# EAGLE design Adafruit EZ-SFX with Amp (EAGLE 6.6.0)
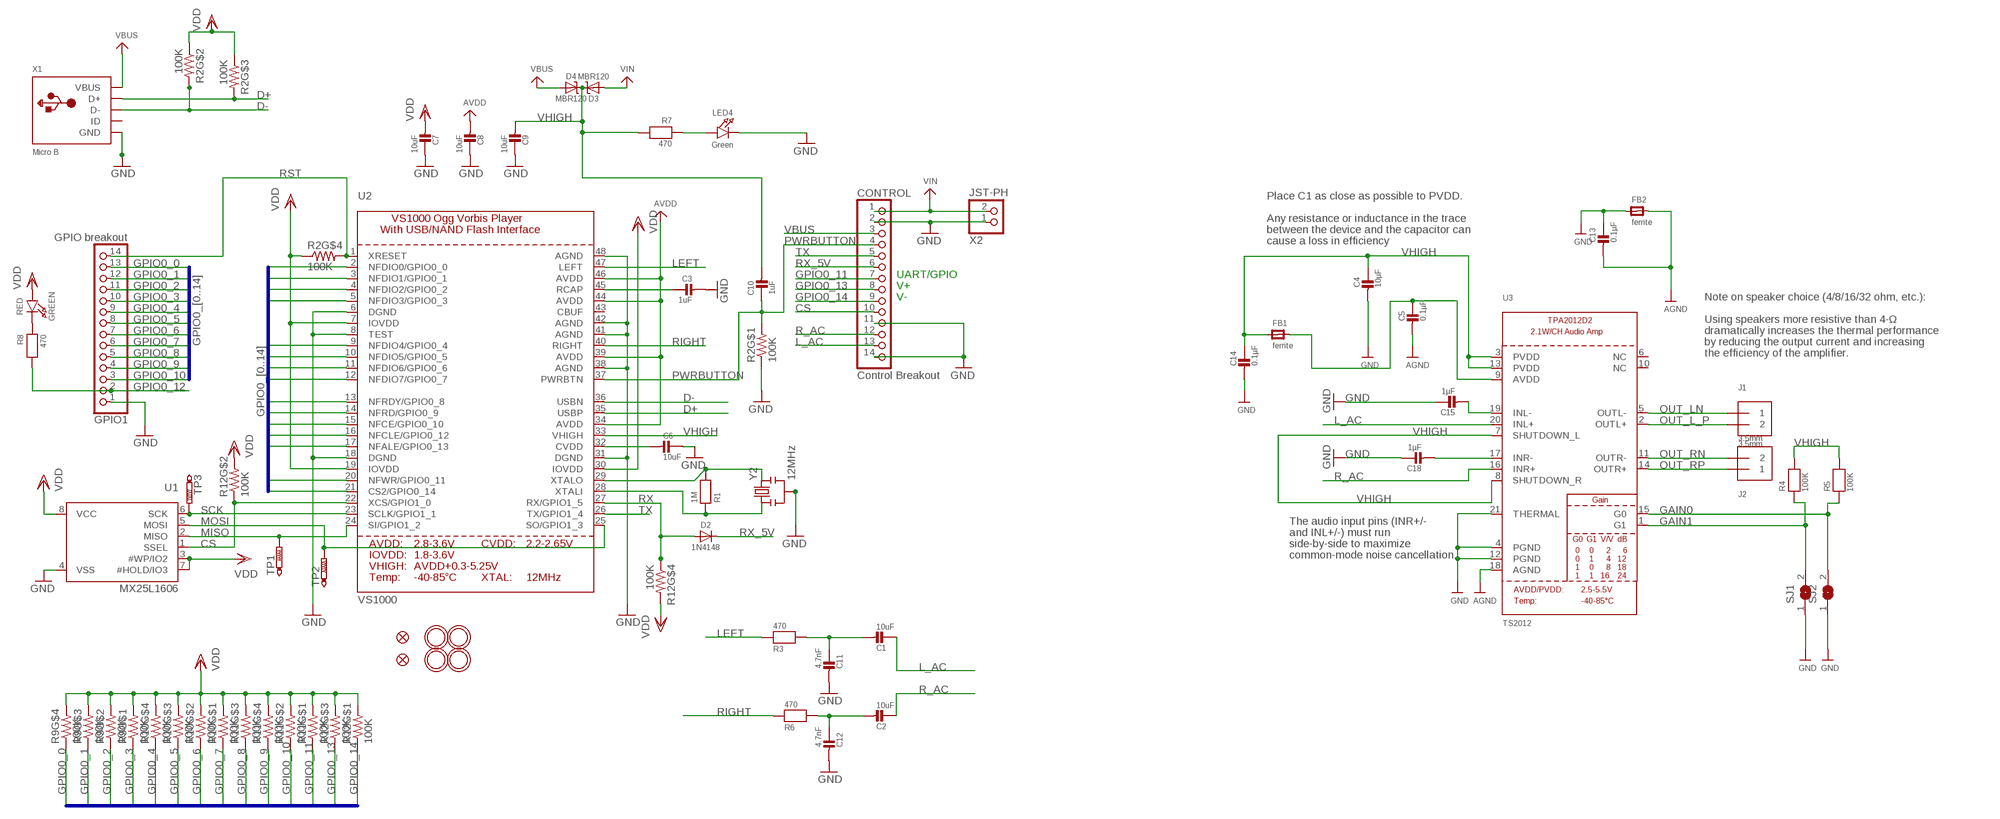
[diagram p0: schematic, sheet 1]

## Parts
C1  10uF  CAP_CERAMIC0805-NOOUTLINE  [0805-NO]
C2  10uF  CAP_CERAMIC0805_10MGAP  [0805_10MGAP]
C3  1uF  CAP_CERAMIC0805-NOOUTLINE  [0805-NO]
C4  10µF  CAP_CERAMIC0805-NOOUTLINE  [0805-NO]
C5  0.1µF  CAP_CERAMIC0805-NOOUTLINE  [0805-NO]
C6  10uF  CAP_CERAMIC0805_10MGAP  [0805_10MGAP]
C7  10uF  CAP_CERAMIC0805_10MGAP  [0805_10MGAP]
C8  10uF  CAP_CERAMIC0805-NOOUTLINE  [0805-NO]
C9  10uF  CAP_CERAMIC0805-NOOUTLINE  [0805-NO]
C10  1uF  CAP_CERAMIC0805-NOOUTLINE  [0805-NO]
C11  4.7nF  CAP_CERAMIC0805-NOOUTLINE  [0805-NO]
C12  4.7nF  CAP_CERAMIC0805-NOOUTLINE  [0805-NO]
C13  0.1µF  CAP_CERAMIC0805-NOOUTLINE  [0805-NO]
C14  0.1µF  CAP_CERAMIC0805-NOOUTLINE  [0805-NO]
C15  1µF  CAP_CERAMIC0805-NOOUTLINE  [0805-NO]
C18  1µF  CAP_CERAMIC0805-NOOUTLINE  [0805-NO]
CONTROL  Control Breakout  PINHD-1X14-CB  [1X14-CB]
D2  1N4148  DIODESOD-323  [SOD-323]
D3  MBR120  DIODE-SCHOTTKYSOD-123  [SOD-123]
D4  MBR120  DIODE-SCHOTTKYSOD-123  [SOD-123]
FB1  ferrite  FERRITE_0805MP  [_0805MP]
FB2  ferrite  FERRITE_0805MP  [_0805MP]
FID1  FIDUCIAL""  [FIDUCIAL_1MM]
FID2  FIDUCIAL""  [FIDUCIAL_1MM]
GPIO1  GPIO breakout  PINHD-1X14-CB  [1X14-CB]
GREEN  RED  LED0805_NOOUTLINE  [CHIPLED_0805_NOOUTLINE]
J1  3.5mm  TERMBLOCK_1X2  [TERMBLOCK_1X2-3.5MM]
J2  3.5mm  TERMBLOCK_1X2  [TERMBLOCK_1X2-3.5MM]
LED4  Green  LED0805_NOOUTLINE  [CHIPLED_0805_NOOUTLINE]
R1  1M  RESISTOR0805_NOOUTLINE  [0805-NO]
R2  100K  RESISTOR_4PACK_US  [RESPACK_4X0603]
R3  470  RESISTOR0805_NOOUTLINE  [0805-NO]
R4  100K  RESISTOR0805_NOOUTLINE  [0805-NO]
R5  100K  RESISTOR0805_NOOUTLINE  [0805-NO]
R6  470  RESISTOR0805_NOOUTLINE  [0805-NO]
R7  470  RESISTOR0805_NOOUTLINE  [0805-NO]
R8  470  RESISTOR0805_NOOUTLINE  [0805-NO]
R9  100K  RESISTOR_4PACK_US  [RESPACK_4X0603]
R10  100K  RESISTOR_4PACK_US  [RESPACK_4X0603]
R11  100K  RESISTOR_4PACK_US  [RESPACK_4X0603]
R12  100K  RESISTOR_4PACK_US  [RESPACK_4X0603]
SJ1  SOLDERJUMPER  [SOLDERJUMPER_ARROW_NOPASTE]
SJ2  SOLDERJUMPERCLOSED  [SOLDERJUMPER_CLOSEDWIRE]
TP1  PTR1B1,27  [B1,27]
TP2  PTR1B1,27  [B1,27]
TP3  PTR1B1,27  [B1,27]
U1  MX25L1606  SPIFLASH_SOIC8208MIL  [SOIC8_208MIL]
U2  VS1000  [LQFP48]
U3  TS2012  AUDIOAMP_TPA2012D2  [WQFN20]
U$5  MOUNTINGHOLE2.5  [MOUNTINGHOLE_2.5_PLATED]
U$6  MOUNTINGHOLE2.5  [MOUNTINGHOLE_2.5_PLATED]
U$7  MOUNTINGHOLE2.5  [MOUNTINGHOLE_2.5_PLATED]
U$8  MOUNTINGHOLE2.5  [MOUNTINGHOLE_2.5_PLATED]
X1  Micro B  USBMICRO_20329  [4UCONN_20329]
X2  JST-PH  CON_JST_PH_2PIN  [JSTPH2]
Y2  12MHz  RESONATORSMD  [RESONATOR-SMD]

## Nets
AGND: C5.2 C13.2 FB2.2 U3.18(AGND)
AVDD: C8.2 U2.34(AVDD) U2.39(AVDD) U2.44(AVDD) U2.46(AVDD)
CS: CONTROL.10 R12.2 U1.1(SSEL) U2.22(XCS/GPIO1_0)
D+: R2.6 U2.35(USBP) X1.D+
D-: R2.7 U2.36(USBN) X1.D-
GAIN0: R5.1 SJ2.2 U3.15(G0)
GAIN1: R4.1 SJ1.2 U3.1(G1)
GND: C3.2 C4.2 C6.1 C7.1 C8.1 C9.1 C11.2 C12.2 C13.1 C14.2 C15.1 C18.1 CONTROL.2 CONTROL.11 CONTROL.14 FB2.1 GPIO1.1 LED4.C R2.1 SJ1.1 SJ2.1 U1.4(VSS) U2.6(DGND) U2.8(TEST) U2.18(DGND) U2.31(DGND) U2.38(AGND) U2.41(AGND) U2.42(AGND) U2.48(AGND) U3.4(PGND) U3.12(PGND) U3.21(THERMAL) X1.BASE@1(GND) X1.BASE@2(GND) X1.GND X1.SPRT@1(GND) X1.SPRT@2(GND) X1.SPRT@3(GND) X1.SPRT@4(GND) X2.1 Y2.2
GPIO0_0: GPIO1.13 R9.4 U2.2(NFDIO0/GPIO0_0)
GPIO0_1: GPIO1.12 R9.3 U2.3(NFDIO1/GPIO0_1)
GPIO0_2: GPIO1.11 R9.2 U2.4(NFDIO2/GPIO0_2)
GPIO0_3: GPIO1.10 R9.1 U2.5(NFDIO3/GPIO0_3)
GPIO0_4: GPIO1.9 R10.4 U2.9(NFDIO4/GPIO0_4)
GPIO0_5: GPIO1.8 R10.3 U2.10(NFDIO5/GPIO0_5)
GPIO0_6: GPIO1.7 R10.2 U2.11(NFDIO6/GPIO0_6)
GPIO0_7: GPIO1.6 R10.1 U2.12(NFDIO7/GPIO0_7)
GPIO0_8: GPIO1.5 R11.3 U2.13(NFRDY/GPIO0_8)
GPIO0_9: GPIO1.4 R11.4 U2.14(NFRD/GPIO0_9)
GPIO0_10: GPIO1.3 R11.2 U2.15(NFCE/GPIO0_10)
GPIO0_11: CONTROL.7 R11.1 U2.20(NFWR/GPIO0_11)
GPIO0_12: GPIO1.2 R8.2 U2.16(NFCLE/GPIO0_12)
GPIO0_13: CONTROL.8 R12.3 U2.17(NFALE/GPIO0_13)
GPIO0_14: CONTROL.9 R12.1 U2.21(CS2/GPIO0_14)
L_AC: C1.1 CONTROL.13 U3.20(INL+)
LEFT: R3.1 U2.47(LEFT)
MISO: TP1.TP U1.2(MISO) U2.24(SI/GPIO1_2)
MOSI: TP2.TP U1.5(MOSI) U2.25(SO/GPIO1_3)
N$1: LED4.A R7.1
N$2: C2.2 C12.1 R6.2
N$3: C3.1 U2.45(RCAP)
N$4: R1.2 U2.29(XTALO) Y2.3
N$5: C6.2 U2.32(CVDD)
N$6: C1.2 C11.1 R3.2
N$7: C5.1 FB1.2 U3.9(AVDD)
N$8: GREEN.C R8.1
N$9: C15.2 U3.19(INL-)
N$10: C18.2 U3.17(INR-)
N$12: R1.1 U2.28(XTALI) Y2.1
OUT_L_P: J1.2 U3.2(OUTL+)
OUT_LN: J1.1 U3.5(OUTL-)
OUT_RN: J2.2 U3.11(OUTR-)
OUT_RP: J2.1 U3.14(OUTR+)
PWRBUTTON: C10.1 CONTROL.4 R2.8 U2.37(PWRBTN)
R_AC: C2.1 CONTROL.12 U3.16(INR+)
RIGHT: R6.1 U2.40(RIGHT)
RST: GPIO1.14 R2.5 U2.1(XRESET)
RX: D2.A R12.4 U2.27(RX/GPIO1_5)
RX_5V: CONTROL.6 D2.C
SCK: TP3.TP U1.6(SCK) U2.23(SCLK/GPIO1_1)
TX: CONTROL.5 U2.26(TX/GPIO1_4)
VBUS: CONTROL.3 D4.A X1.VBUS
VDD: C7.2 GREEN.A R2.2 R2.3 R2.4 R9.5 R9.6 R9.7 R9.8 R10.5 R10.6 R10.7 R10.8 R11.5 R11.6 R11.7 R11.8 R12.5 R12.6 R12.7 R12.8 U1.3(#WP/IO2) U1.7(#HOLD/IO3) U1.8(VCC) U2.7(IOVDD) U2.19(IOVDD) U2.30(IOVDD)
VHIGH: C4.1 C9.2 C10.2 C14.1 D3.C D4.C FB1.1 R4.2 R5.2 R7.2 U2.33(VHIGH) U3.3(PVDD) U3.7(SHUTDOWN_L) U3.8(SHUTDOWN_R) U3.13(PVDD)
VIN: CONTROL.1 D3.A X2.2
Unconnected: U2.43(CBUF) U3.6(NC) U3.10(NC) X1.ID

## Buses
GPIO0_[0..14]

## Notes on the sheet
- Place C1 as close as possible to PVDD.
- Any resistance or inductance in the trace
- between the device and the capacitor can
- cause a loss in efficiency
- UART/GPIO
- V+
- V- | Note on speaker choice (4/8/16/32 ohm, etc.):
- Using speakers more resistive than 4-Ω
- dramatically increases the thermal performance
- by reducing the output current and increasing
- the efficiency of the amplifier.
- The audio input pins (INR+/-
- and INL+/-) must run
- side-by-side to maximize
- common-mode noise cancellation.

## Library data of the parts
C1-C15 C18 = microbuilder:CAP_CERAMIC: Ceramic Capacitors For new designs, use the packages preceded by an '_' character since they are more reliable: The following footprints should be used on most boards: _0402 - Standard footprint for regular board layouts _0603 - Standard footprint for regular board layouts _0805 - Standard footprint for regular board layouts For extremely tight-pitch boards where space is at a premium, the following 'micro-pitch' footprints can be used (smaller pads, no silkscreen outline, etc.): _0402MP - Micro-pitch footprint for very dense/compact boards _0603MP - Micro-pitch footprint for very dense/compact boards _0805MP - Micro-pitch footprint for very dense/compact boards Commonly Stocked Parts 0402 - 0402 Surface Mount Capacitors 16pF 50V 5% [Digikey: 445-4899-2-ND] 18pF 50V 5% [Digikey: 490-1281-2-ND] 22pF 50V 5% [Digikey: 490-1283-2-ND] 68pF 50V 5% [Digikey: 490-1289-2-ND] 0.1uF 10V 10% [Digikey: 490-1318-2-ND] 1.0uF 6.3V 10% [Digikey: 490-1320-2-ND] 0603 - 0603 Surface Mount Capacitors 16 pF 50V 5% [Digikey: 445-5051-2-ND] 22 pF 50V [Digikey: PCC220ACVTR-ND] 33 pF 50V 5% [Digikey: 490-1415-1-ND] 56pF 50V 5% [Digikey: 490-1421-1-ND] 220pF 50V 5% [Digikey: 445-1285-1-ND] 680 pF 50V 2200 pF 50V 5% C0G [Digikey: 445-1297-1-ND] 5600 pF 100V 5% X7R [Digikey: 478-3711-1-ND] 0.1 µF 25V 10% [Digikey: PCC2277TR-ND] 0.22 µF 16V 10% X7R [Digikey: 445-1318-1-ND] 1.0 µF 25V 10% [Digikey: 445-5146-2-ND] 0603 - RF Specific 3pF 250V +/-0.1pF RF [Digikey: 712-1347-1-ND] 18 pF 250V 5% [Digikey: 478-3505-1-ND or 712-1322-1-ND] 56 pF 250V 5% C0G RF [Digikey: 490-4867-1-ND] 68 pF 250V RF [Digikey: 490-4868-1-ND] 0805 - 0805 Surface Mount Capacitors 220 pF 250V 2% RF Ceramic Capacitor [Digikey: 712-1398-1-ND] 1000 pF 50V 2% NP0 Ceramic Capacitor [Digikey: 478-3760-1-ND] 0.1 µF 25V 10% Ceramic Capacitor [Digikey: PCC1828TR-ND] 1.0 µF 16V 10% Ceramic Capacitor[Digikey: 490-1691-2-ND] 10.0 µF 10V 10% Ceramic Capacitor[Digikey: 709-1228-1-ND] 10.0 uF 16V 10% Ceramic Capacitor [Digikey: 478-5165-2-ND] 47 uF 6.3V 20% Ceramic Capacitor [Digikey: 587-1779-1-ND or 399-5506-1-ND] 1206 - 1206 Surface Mount Capacitors 47uF 10V 20% Ceramic Capacitor [Digikey: 490-5528-1-ND or 399-5508-1-ND or 445-6010-1-ND] 100uF 6.3V -20%, +80% Y5V Ceramic Capacitor (Digikey: 490-4512-1-ND, Mouser: 81-GRM31CF50J107ZE1L)
CONTROL GPIO1 = adafruit:PINHD-1X14: PIN HEADER
D2 = microbuilder:DIODE: Diode SMA Model Volts Amps Type Vf Ir Digikey # Notes SSA34-E3 40V 3A Schottky 480mV @ 3A 200uA @ 40V SSA34-E3/61TGITR-ND CDBA120-G 20V 1A Schottky 500mV @ 1A 500uA @ 20V 641-1014-6-ND REEL MBRA210 10V 2A Schottky 350mV @ 2A 700uA @ 10V MBRA210LT3 SOD-123 Model Volts Amps Type Vf Ir Order # Notes BAT54T1G 30V 200mA Schottky 800mV @ 200mA 2uA @ 25V BAT54T1GOSTR-ND B0530W 30V 500mA Schottky 430mV @ 500mA 130uA @ 30V B0530W-FDICT-ND REEL MBR120 20V 1A Schottky 340mV @ 1A MBR120VLSFT1GOSCT-ND SOD-323 Model Volts Amps Type Vf Ir Order # Notes PMEG2005EJ 20V 500mA Schottky 355mV @ 500mA 568-4110-1-ND ZLLS410 10V 570mA Schottky 380mV @ 570mA ZLLS410CT-ND 1N4148WS 75V 150mA Silicon/Simple 1V 1N4148WSFSCT-ND REEL SOD-523 Model Volts Amps Type Vf Ir Order # Notes BAT54XV2 30V 200mA Schottky 0.8V @ 100mA BAT54XV2CT-ND TB751S 30V 30mA Schottky RB751S-40TE61CT-ND SOT23-R/W (R = Solder Paste/Reflow Ovens, W = Hand-Soldering) Model Volts Amps Type Vf Ir Order # Notes BAT54FILM 40V 300mA Schottky 497-7162-1-ND POWERDI-5 Model Volts Amps Type Vf Ir Order # Notes PDS560 60V 5A Schottky 670mV @ 5A 150uA @ 60V PDS560DICT-ND
D3 D4 = microbuilder:DIODE-SCHOTTKY
FB1 FB2 = microbuilder:FERRITE: Ferrite Bead 0603 MMZ1608B121C - 120 Ohm @ 100MHz, 600mA, 0.15 Ohm DC Resistance - Digikey: 445-2164-1-ND BK1608HW121-T - 120 Ohm, 600mA Ferrite Chip - Digikey: 587-1876-2-ND 0805 HZ0805B272R-10 - 2.7K Ohm @ 100MHz, 200mA, 0.8 Ohm DC Resistance - Digikey: 240-2504-1-ND (see also Murata BLM21BD272SN1L) MMZ2012Y152B - 1.5K Ohm @ 100MHz, 500mA, 0.4 Ohm DC Resistance - Digikey: 445-1560-1-ND - Mainly for high frequency (80-400MHz) MMZ2012R102A - 1K Ohm @ 100MHz, 500mA, 0.3 Ohm DC Resistance - Digikey: 445-1555-2-ND - More general purpose (10-200MHz)
FID1 FID2 = microbuilder:FIDUCIAL: Fiducial Alignment Points Various fiducial points for machine vision alignment.; BOM: EXCLUDE
GREEN LED4 = microbuilder:LED: LED 0603 - 0603 Surface Mount Package 2mA: Green LED - Low Power (3.9mcd, 2ma, 1.7Vf) - Digikey: 475-2709-2-ND Orange LED - Low Power (9.8mcd, 2ma, 1.8Vf) - Digikey: 475-1194-2-ND Red LED - Low Power (5mcd, 2ma, 1.8Vf) - Digikey: 475-1195-2-ND Yellow LED - Low Power (7mcd, 2ma, 1.8Vf) - Digikey: 475-1196-2-ND 5mA: Blue LED - Low Power (17mcd, 5ma, 2.9Vf) - Digikey: LNJ937W8CRACT-ND 0805 - 0805 Surface Mount Package 2mA: Red LED (8.8mcd, 2mA, 1.8Vf, Clear) - Low Power [Digikey: 475-2510-1-ND] Green LED (5mcd, 2mA, 1.8Vf, Clear) - Low Power [Digikey: 475-2730-1-ND] Yellow LED (11.3mcd, 2mA, 1.8Vf, Clear) - Low Power [Digikey: 475-2555-1-ND] 20mA: Red LED (104mcd, 20mA, Diffused) - LS R976 [Digikey: 475-1278-6-ND] Red LED (12mcd, 20mA, 2.0Vf, Clear) - APT2012EC [Digikey: 754-1128-1-ND] Green LED (15mcd, 20mA, 2.2Vf, Clear) - APT2012GC [Digikey: 754-1131-1-ND] Orange LED (160mcd, 20mA, 2.1Vf, Clear) - APT2012SECK [Digikey: 754-1130-1-ND] 1206 - 1206 Surface Mount Package Green LED (26mcd, 20mA, Diffused) - LG N971 [Digikey: 475-1407-6-ND] Red LED (15mcd, 20mA, Diffused) - LH N974 [Digikey: 475-1416-6-ND] Cree - Cree High-Power Surface Mount LEDs XPEBWT-L1-0000-00D50 - White 111lm 350mA 2.9Vf 6200K 110° XTEAWT-00-0000-00000LEE3 - White 114lm 350mA 2.85Vf 5000K 115° Everlight - Everlight 45-21 Series Surface Mount LEDs 45-21/QK2C-B2832AC2CB2/2T - Warm White 2000mcd 20mA 3.25Vf 3050K 120° 45-21/LK2C-B38452C4CB2/2T - Nuetral White 2000mcd 20mA 3.25Vf 4150K 120° 45-21/LK2C-B50634C6CB2/2T - Cold White 2200mcd 20mA 3.25Vf 5650K 120° PLCC2 Reverse Mount LS T77K-J1L2-1-0-2-R18-Z - Red 11.25mcd 2mA 1.8Vf 630nm 120° LO T77K-L1M2-24-Z - Orange 19.6mcd 2mA 1.8Vf 606nm 120° LY T77K-K2M1-26-Z - Yellow 15.7mcd 2mA 1.8Vf 587nm 120°
J1 J2 = microbuilder:TERMBLOCK_1X2: 3.5mm Terminal block http://www.ladyada.net/library/pcb/eaglelibrary.html
R1 R3-R8 = microbuilder:RESISTOR: Resistors For new designs, use the packages preceded by an '_' character since they are more reliable: The following footprints should be used on most boards: _0402 - Standard footprint for regular board layouts _0603 - Standard footprint for regular board layouts _0805 - Standard footprint for regular board layouts For extremely tight-pitch boards where space is at a premium, the following 'micro-pitch' footprints can be used (smaller pads, no silkscreen outline, etc.): _0402MP - Micro-pitch footprint for very dense/compact boards _0603MP - Micro-pitch footprint for very dense/compact boards _0805MP - Micro-pitch footprint for very dense/compact boards
R2 R9-R12 = microbuilder:RESISTOR_4PACK_US: Resistor Packs (4 resistors) 4 x 0603 10K 1/16W - Digikey: YC164J-10KCT-ND
SJ1 = microbuilder:SOLDERJUMPER: SMD Solder JUMPER Solder the two pads together to create a connection, or remove the solder to break it. REFLOW - Use this footprint for solder paste and reflow ovens. WAVE - Use this footprint for hand-soldering (larger pads). CLOSED - Has a trace between the two pads to ensure it is closed by default. The trace needs to be cut to disable the jumper, and can be closed again by creating a solder bridge between the two pads.; BOM: EXCLUDE
SJ2 = microbuilder:SOLDERJUMPER: SMD Solder JUMPER Solder the two pads together to create a connection, or remove the solder to break it. REFLOW - Use this footprint for solder paste and reflow ovens. WAVE - Use this footprint for hand-soldering (larger pads). CLOSED - Has a trace between the two pads to ensure it is closed by default. The trace needs to be cut to disable the jumper, and can be closed again by creating a solder bridge between the two pads.
TP1-TP3 = testpad:PTR1: TEST PIN
U1 = microbuilder:SPIFLASH_SOIC8: SOIC8 SPI Flash Be careful with the size since SOIC8 flash comes in several 'widths' SOIC8 150 mil M25P16 - 16Mbit (2Mbit x 8) Serial Flash (75MHz SPI Bus), Supply: 2.7-3.6V Digikey: SOIC8 - M25P16-VMN6P-ND SOIC8 208 mil W25Q16BVSSIG - 16Mbit (2Mbit x 8) Serial Flash (104MHz SPI Bus), Supply: 2.7-3.6V Digikey: SOIC8 - W25Q16BVSSIG-ND
U2 = microbuilder:VS1000: VS1000 Ogg Vorbis Player
U3 = microbuilder:AUDIOAMP_TPA2012D2: TPA2012D2 2.1W/CH Stereo Class-D Audio Amp 2.1W/Ch into 4 Ohm at 5V 1.4W/Ch into 8 Ohm at 5V 720mW/Ch into 8 ohm at 3.6V Selectable Gain: 6, 12, 18 or 24 dB Power Supply (PVDD and AVDD): 2.5-5.5V Operating Temperature: -40 to 85°C Digikey (QFN20): 296-17692-1-ND
U$5-U$8 = microbuilder:MOUNTINGHOLE: Mounting Hole For #2 screws (0.086"/2.18mm width, 0.094"/2.4mm hole) use 2.5mm; BOM: EXCLUDE
X1 = microbuilder:USB: USB Connectors USBMINIB - Surface Mount Female Mini-B USB Connector 4UConnector: 06564
X2 = microbuilder:CON_JST_PH_2PIN: JST 2-Pin Right-Angle Connector PH-Series - 4UConnector: 17311 SH-Series - 4UConnector: 07278
Y2 = SparkFun:RESONATOR: Resonator Small SMD resonator. This is the itty bitty 10/20MHz resonators with built in caps. CSTCE10M0G55 and CSTCE20M0V53. Footprint has been reviewed closely but hasn't been tested yet.

## Board
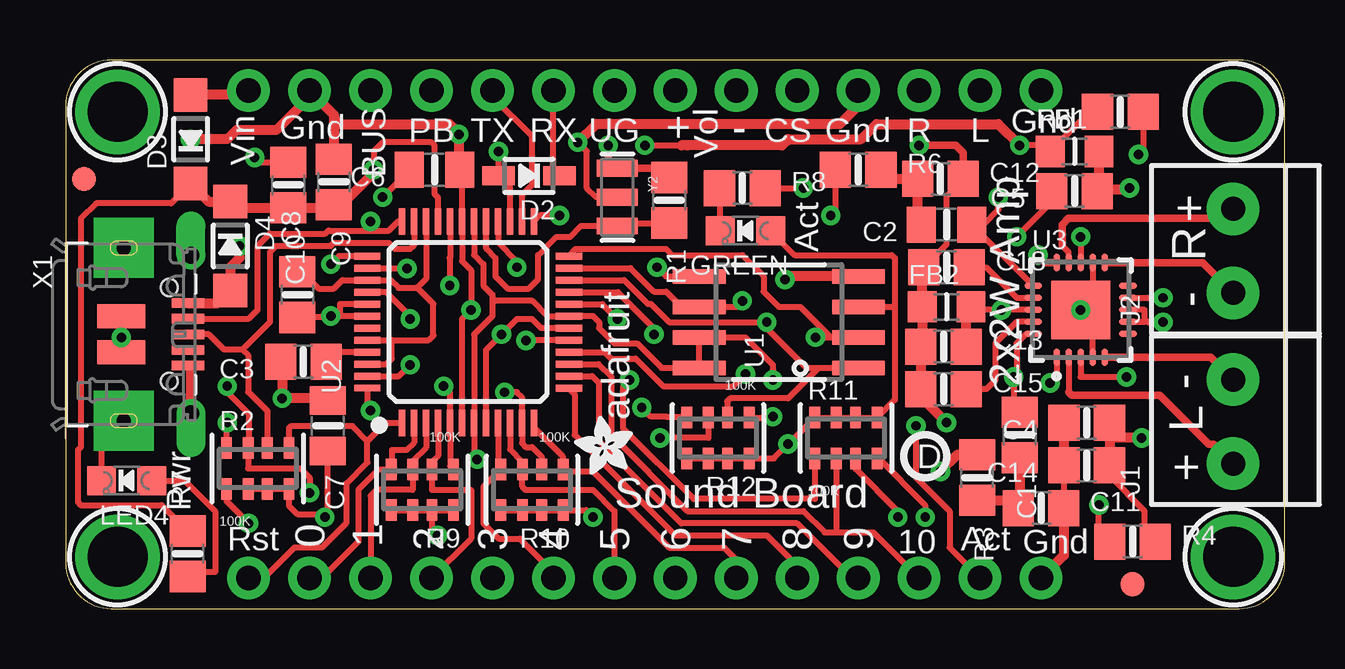
[diagram p1: board, top side]
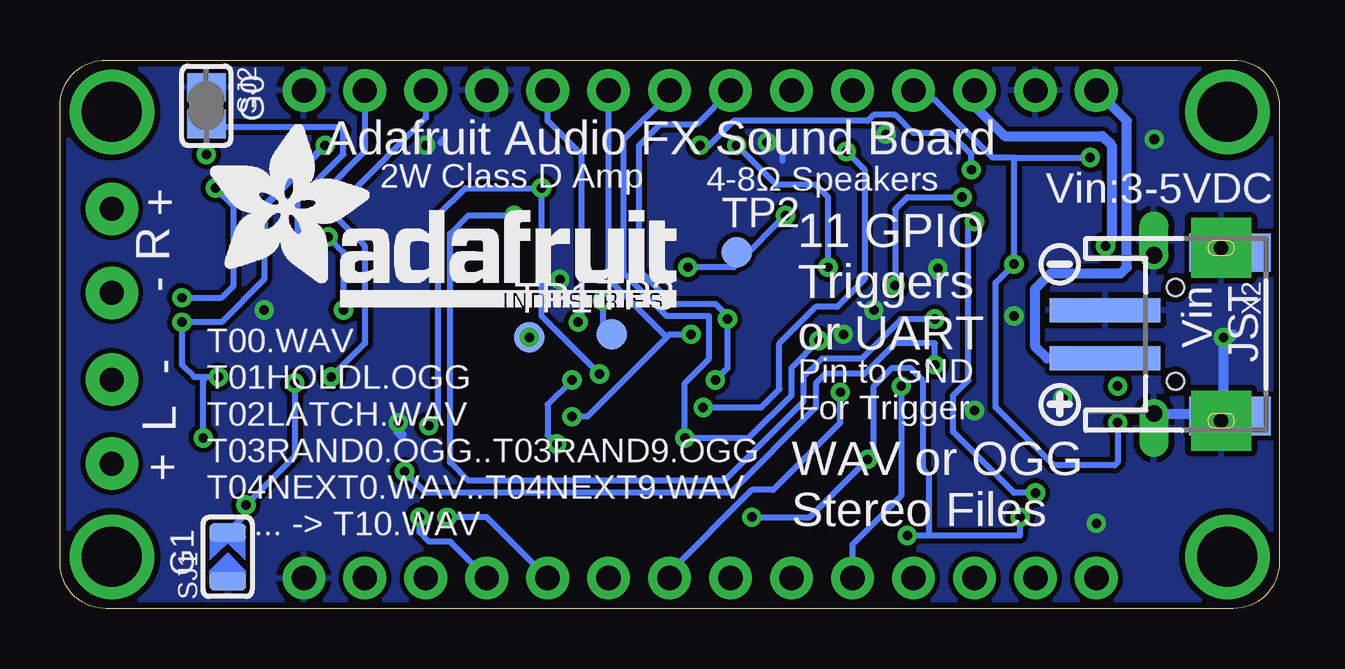
[diagram p2: board, bottom side, seen from below]

Size 50.8 x 22.86 mm. Coordinates in mm from the lower left corner, seen from the top.
Outline: 0,20.95 0,1.91 arc90 1.91,0 48.9,0 arc90 50.8,1.91 50.8,20.95 arc90 48.9,22.86 1.91,22.86 arc90 0,20.95
Copper layers (1*16): Top 0.035mm / dielectric 1.5mm / Bottom 0.035mm
Design rules "adafruit *": minimum track width 10mil, minimum drill 15.5mil, track to track 8mil, track to pad 8mil, pad to pad 8mil, via to via 8mil, smd to smd 8mil, copper to edge 10mil, drill to drill 8mil, minimum pad ring 10mil, minimum via ring 8mil, stop-mask expansion 2mil, vias tented up to drill 20mil, thermal gap 10mil

### Footprints (pad centres in the part's own frame; a part is rotated, then mirrored left to right if it is on the bottom)
0805-NO = smd 1.3 x 1.5: 1 -0.95,0; 2 0.95,0
0805_10MGAP = smd 1.2 x 1.5: 1 -1.05,0; 2 1.05,0
1X14-CB = drill 1.016 pad 1.778: 1 -16.51,0; 2 -13.97,0; 3 -11.43,0; 4 -8.89,0; 5 -6.35,0; 6 -3.81,0; 7 -1.27,0; 8 1.27,0; 9 3.81,0; 10 6.35,0; 11 8.89,0; 12 11.43,0; 13 13.97,0; 14 16.51,0
SOD-323 = smd 1.35 x 0.8: A 1.27,0; C -1.27,0
SOD-123 = smd 1.4 x 1.4: A 1.85,0; C -1.85,0
_0805MP = smd 1.2 x 1.3: 1 -1.016,0; 2 1.016,0
FIDUCIAL_1MM = smd 1 x 1: 1 0,0
CHIPLED_0805_NOOUTLINE = smd 1.2 x 1.2: A 0,-1.05; C 0,1.05
TERMBLOCK_1X2-3.5MM = drill 1 pad 2.184: 1 1.8,0; 2 -1.7,0
RESPACK_4X0603 = smd 0.45 x 0.9: 1 -1.3,-0.85; 2 -0.4,-0.85; 3 0.4,-0.85; 4 1.3,-0.85; 5 1.3,0.85; 6 0.4,0.85; 7 -0.4,0.85; 8 -1.3,0.85
SOLDERJUMPER_ARROW_NOPASTE = smd 0.762 x 1.524: 1 -1.016,0; 2 1.016,0
SOLDERJUMPER_CLOSEDWIRE = smd 1.168 x 1.6: 1 -0.762,0; 2 0.762,0 | smd 0.635 x 0.203: WIRE 0,0
B1,27 = smd 1.27 x 1.27: TP 0,0
SOIC8_208MIL = smd 0.6 x 2.2: 1 -1.905,-3.315; 2 -0.635,-3.315; 3 0.635,-3.315; 4 1.905,-3.315; 5 1.905,3.315; 6 0.635,3.315; 7 -0.635,3.315; 8 -1.905,3.315
LQFP48 = smd 1.1 x 0.285: 1 -4.2,2.75; 2 -4.2,2.25; 3 -4.2,1.75; 4 -4.2,1.25; 5 -4.2,0.75; 6 -4.2,0.25; 7 -4.2,-0.25; 8 -4.2,-0.75; 9 -4.2,-1.25; 10 -4.2,-1.75; 11 -4.2,-2.25; 12 -4.2,-2.75; 25 4.2,-2.75; 26 4.2,-2.25; 27 4.2,-1.75; 28 4.2,-1.25; 29 4.2,-0.75; 30 4.2,-0.25; 31 4.2,0.25; 32 4.2,0.75; 33 4.2,1.25; 34 4.2,1.75; 35 4.2,2.25; 36 4.2,2.75 | smd 0.285 x 1.1: 13 -2.75,-4.2; 14 -2.25,-4.2; 15 -1.75,-4.2; 16 -1.25,-4.2; 17 -0.75,-4.2; 18 -0.25,-4.2; 19 0.25,-4.2; 20 0.75,-4.2; 21 1.25,-4.2; 22 1.75,-4.2; 23 2.25,-4.2; 24 2.75,-4.2; 37 2.75,4.2; 38 2.25,4.2; 39 1.75,4.2; 40 1.25,4.2; 41 0.75,4.2; 42 0.25,4.2; 43 -0.25,4.2; 44 -0.75,4.2; 45 -1.25,4.2; 46 -1.75,4.2; 47 -2.25,4.2 | smd 0.28 x 1.1: 48 -2.75,4.2
WQFN20 = smd 0.28 x 0.75: 1 -1,-1.975; 2 -0.5,-1.975; 3 0,-1.975; 4 0.5,-1.975; 5 1,-1.975; 11 1,1.975; 12 0.5,1.975; 13 0,1.975; 14 -0.5,1.975; 15 -1,1.975 | smd 0.75 x 0.28: 6 1.975,-1; 7 1.975,-0.5; 8 1.975,0; 9 1.975,0.5; 10 1.975,1; 16 -1.975,1; 17 -1.975,0.5; 18 -1.975,0; 19 -1.975,-0.5; 20 -1.975,-1 | smd 2.45 x 2.45: 21 0,0
MOUNTINGHOLE_2.5_PLATED = drill 2.5 pad 3.2: P$1 0,0
4UCONN_20329 = smd 1 x 2: BASE@1 -0.75,-2; BASE@2 0.75,-2 | smd 0.4 x 1.35: D+ 0,0.775; D- -0.65,0.775; GND 1.3,0.775; ID 0.65,0.775; VBUS -1.3,0.775 | drill 0.7 offset: SPRT@1 -3.3,0.9; SPRT@2 3.3,0.9 | drill 0.6 pad 2.5 square: SPRT@3 -3.6,-1.9; SPRT@4 3.6,-1.9 | hole 0.7: -1.95,0; 1.95,0
JSTPH2 = smd 1 x 4.6: 1 -1,-3.7; 2 1,-3.7 | smd 1.6 x 3.4: NC1 -3.4,1.5; NC2 3.4,1.5
RESONATOR-SMD = smd 0.7 x 1.7: 1 -1.2,0; 2 0,0; 3 1.2,0

### Placement (x,y rotation side)
C1  39.75,7.24 270 top
C2  36.7,16 180 top
C3  9.91,10.29 180 top
C4  42.55,7.75 180 top
C5  42.04,17.4 180 top
C6  15.37,18.29 180 top
C7  10.92,7.62 270 top
C8  9.65,13.08 90 top
C9  11.18,17.78 270 top
C10  9.27,17.65 270 top
C11  40.64,4.19 0 top
C12  36.45,17.91 0 top
C13  36.58,10.92 0 top
C14  42.55,5.97 180 top
C15  36.58,9.14 0 top
C18  36.7,14.22 0 top
CONTROL  24.13,21.59 0 top
D2  19.3,18.03 180 top
D3  5.21,19.56 90 top
D4  6.86,15.11 270 top
FB1  42.04,19.05 0 top
FB2  36.7,12.57 0 top
FID1  44.45,1.02 0 top
FID2  0.76,17.91 0 top
GPIO1  24.13,1.27 180 top
GREEN  28.32,15.75 90 top
J1  48.64,7.75 90 top
J2  48.64,14.86 90 top
LED4  2.54,5.33 90 top
R1  25.15,17.02 270 top
R2  8,5.84 0 top
R3  37.97,5.46 270 top
R4  44.45,2.79 0 top
R5  43.94,20.7 180 top
R6  33.02,18.29 0 top
R7  5.08,2.29 90 top
R8  28.19,17.53 0 top
R9  14.86,4.95 180 top
R10  19.43,4.95 180 top
R11  32.51,7.11 0 top
R12  27.18,7.11 180 top
SJ1  43.81,2.16 90 bottom
SJ2  44.7,20.95 270 bottom
TP1  31.24,11.3 0 bottom
TP2  22.61,14.86 0 bottom
TP3  27.81,11.43 0 bottom
U1  29.72,11.94 90 top
U2  16.76,11.94 90 top
U3  42.29,12.45 0 top
U$5  2.16,20.7 0 top
U$6  2.16,2.16 0 top
U$7  48.64,20.7 0 top
U$8  48.64,2.16 0 top
U$11  [ADAFRUIT_2.5MM]  23.62,5.59 90 top
U$12  [SYMBOL_PLUS]  9.14,8.51 0 bottom
U$13  [SYMBOL_MINUS]  9.14,14.35 0 bottom
U$14  [ADAFRUIT_TEXT_20MM]  44.7,12.57 0 bottom
U$15  [PCBFEAT-REV-040]  35.81,6.35 0 top
X1  4.32,11.43 270 top
X2  3.56,11.43 270 bottom
Y2  22.99,17.14 270 top

### Tracks (layer width: path | path; a pad name or v marks a point on that pad's centre or on a via)
AGND  (via drill 0.39)
  Top 0.254: U3.18 v38.99,12.45 38.1,12.45 | C5.2 41.09,16.96 v39.62,15.49
  Top 0.406: C13.2 37.53,12.38 FB2.2 37.85,12.45 38.1,12.45
  Bottom 0.254: v39.62,15.49 38.99,14.86 v38.99,12.45
AVDD
  Top 0.254: U2.44 13.59,11.19 | 13.59,11.19 15.12,11.19 15.32,11.38 15.32,12.7 14.64,13.37 | U2.46 13.36,10.19 13.59,10.41 13.59,11.19 | C8.2 9.85,14.03 10.54,13.34 11.18,13.34 11.53,13.69 U2.39 13.54,13.69 13.87,13.36 14.61,13.36 14.62,13.37 14.64,13.37 | U2.34 15.01,13.74 14.64,13.37
CS  (via drill 0.39)
  Top 0.254: 29.08,11.94 25.15,11.94 24.38,12.7 24.26,12.7 23.27,13.69 U2.22 | v29.21,11.94 29.08,11.94 | 33.16,10.03 U1.1 31.37,10.03 | 29.08,11.94 29.08,11.81 30.86,10.03 31.37,10.03 | 31.37,10.03 30.1,8.76 27.69,8.76 27.56,8.64 27.56,7.98 R12.2
  Bottom 0.254: v29.21,11.94 29.08,11.94 29.08,18.92 30.48,20.32 CONTROL.10
D+
  Top 0.254: U2.35 14.51,15.15 14.35,14.99 13.72,14.99 13.46,15.24 11.18,15.24 11.05,15.11 8.76,15.11 8.51,14.86 8.51,11.94 7.37,10.79 | 7.37,10.79 6.6,10.79 5.97,11.43 X1.D+ | 7.37,10.79 7.6,10.56 7.6,9.04 8.4,8.24 R2.6
D-  (via drill 0.39, 0.4)
  Top 0.254: 12.7,15.75 10.95,15.75 10.82,15.62 8.51,15.62 8,15.11 8,12.45 7.63,12.08 X1.D- | v6.73,9.27 6.73,9.02 7.62,8.13 7.62,6.71 R2.7 7.6,5.84 9.78,5.84 10.16,5.46 v10.16,4.83 | U2.36 13.85,16.14 13.46,15.75 12.83,15.75 12.7,15.75 | v12.7,16.13 12.7,15.75
  Bottom 0.254: v10.16,4.83 11.05,4.83 13.59,7.37 13.59,8.89 12.95,9.53 12.95,15.88 v12.7,16.13
GAIN0  (via drill 0.39)
  Top 0.254: R5.1 44.89,19.11 v44.7,18.92
  Top 0.305: U3.15 40.82,14.42 v40.51,14.73
  Bottom 0.254: v40.51,14.73 40.89,15.11 40.89,17.02 38.99,18.92 38.99,19.94 39.12,20.07 44.58,20.07 SJ2.2 v44.7,18.92
GAIN1  (via drill 0.39)
  Top 0.254: U3.1 41.29,9.67 v41.02,9.4 | v43.05,4.32 43.05,3.24 43.06,3.24 R4.1
  Bottom 0.254: v41.02,9.4 41.02,6.35 v43.05,4.32 43.05,3.94 SJ1.2
GND  (via drill 0.39, 0.4)
  Top 0.254: U2.41 11.43,12.69 11.43,12.19 | U2.42 11.43,12.19 | U2.38 14.21,14.19 v14.22,14.17 | U2.8 17.51,10.78 v18.16,11.43 18.8,12.06 19.43,12.06 19.81,11.69 U2.18 | 30.23,13.84 30.1,13.84 | C6.1 16.51,18.19 U2.31 16.51,14.48 16.89,14.11 v16.89,12.45 16.51,12.06 U2.6 | C8.1 10.99,12.13 v11.05,12.19 11.43,12.19 | Y2.2 22.1,17.14 21.72,17.53 21.72,19.05 v21.34,19.43 | X1.SPRT@4 1.49,6.9 LED4.C | R2.1 6.7,4.47 v7.62,3.56 | U2.48 12.56,8.39 v12.7,8.26 | 36.2,14.22 C18.1 36.1,14.57 36.7,15.17 36.7,17.21 C12.2 | U3.12 42.79,12.95 U3.21 42.79,11.95 U3.4 | 41.59,6.22 C14.2 C11.2 | 16.38,19.51 v16.38,19.76
  Top 0.305: C12.2 37.4,18.99 37.08,19.3 v35.56,19.3
  Top 0.406: U1.4 30.23,13.84 | 30.1,13.84 v29.97,13.72 | CONTROL.11 33.02,20.95 32.26,20.19 22.1,20.19 v21.34,19.43 | X1.BASE@1 v2.32,11.3 X1.BASE@2 | X1.GND 5.22,10.01 X1.SPRT@2 | CONTROL.2 10.29,21.46 | 10.29,21.46 11.18,20.57 11.18,20.45 | 11.18,20.45 C9.1 | C3.2 9.02,10.23 v9.02,8.76 10.83,8.76 C7.1 | 11.18,20.45 11.43,20.19 16,20.19 16.38,19.81 16.38,19.51 16.38,18.32 C6.1 | 10.29,21.46 8.76,19.94 7.11,19.94 6.73,19.56 v5.21,19.56 | C13.1 C15.1 35.94,8.83 35.94,8.51 v36.7,7.75 | C4.2 C14.2 | 36.1,14.57 35.69,14.16 FB2.1 35.69,10.92 | C11.2 41.59,2.22 GPIO1.1
  Bottom 0.254: 14.35,13.84 14.1,13.84 | v29.97,13.72 29.97,13.34 | 20.7,18.92 20.7,18.67
  Bottom 0.305: 34.92,19.43 34.8,19.56
  Bottom 0.406: 1.91,11.43 2.04,11.3 v2.32,11.3 2.32,8.73 2.92,8.13 X1.SPRT@2 | v5.21,19.56 5.08,19.43 5.08,19.68 | v36.7,7.75 36.7,7.37 36.58,7.24
  other vias: 42.29,12.45
  pour Bottom: 50.93,23.24 -0.38,22.98 -0.38,-0.38 50.93,-0.13
GPIO0_0
  Top 0.254: U2.2 14.51,6.92 14.2,6.6 13.59,6.6 13.59,5.83 R9.4 13.04,5.8 12.19,4.95 12.19,2.79 10.67,1.27 GPIO1.13
GPIO0_1
  Top 0.254: U2.3 15.01,6.71 14.46,6.15 R9.3 14.46,4.95 12.95,4.95 12.7,4.7 GPIO1.12
GPIO0_2
  Top 0.254: GPIO1.11 16.89,2.92 16.89,4.95 15.26,4.95 R9.2 15.26,6.12 15.51,6.37 U2.4
GPIO0_3  (via drill 0.39)
  Top 0.254: v15.75,9.27 16.01,9.01 U2.5 16.01,5.95 R9.1
  Bottom 0.254: v15.75,9.27 15.75,4.7 17.78,2.67 GPIO1.10
GPIO0_4
  Top 0.254: GPIO1.9 20.32,1.52 18.92,2.92 18.03,2.92 17.4,3.56 17.4,5.07 R10.4 18.01,5.92 U2.9
GPIO0_5
  Top 0.254: U2.10 18.51,6.63 19.03,6.12 R10.3 19.03,5.08 19.16,4.95 21.97,4.95 22.86,4.06 GPIO1.8
GPIO0_6  (via drill 0.39)
  Top 0.254: R10.2 19.83,6.33 19.43,6.73 19.18,6.73 19.01,6.89 U2.11 19.01,8.8 18.8,9.02 v18.29,9.02 18.25,8.98
  Bottom 0.254: v18.29,9.02 18.29,7.75 21.08,4.95 21.97,4.95 25.4,1.52 GPIO1.7
GPIO0_7
  Top 0.254: 20.7,5.73 20.7,5.84 20.73,5.81 R10.1 | GPIO1.6 27.94,2.03 27.43,2.54 25.15,2.54 21.98,5.7 20.83,5.7 R10.1 | U2.12 19.51,7.54 20.7,6.35 20.7,5.83 R10.1
GPIO0_8  (via drill 0.39)
  Top 0.254: R11.3 32.91,5.82 34.67,4.06 v34.67,3.81 | GPIO1.5 30.48,1.78 29.21,3.05 25.4,3.05 21.21,7.24 21.21,8.94 U2.13
  Bottom 0.254: GPIO1.5 33.02,3.81 v34.67,3.81
GPIO0_9  (via drill 0.39)
  Top 0.254: U2.14 21.93,9.69 22.23,9.4 22.23,6.99 25.65,3.56 30.48,3.56 32.77,1.27 GPIO1.4 | 35.81,3.85 v35.81,3.81 35.81,4.32 33.81,6.32 R11.4
  Bottom 0.254: GPIO1.4 34.54,2.79 35.43,2.79 35.81,3.17 v35.81,3.81
GPIO0_10
  Top 0.254: U2.15 22.2,10.19 22.73,9.65 22.73,7.24 25.91,4.06 30.73,4.06 31.62,3.17 32.11,3.17 | 32.11,3.17 33.66,3.17 GPIO1.3 | R11.2 32.11,3.17
GPIO0_11  (via drill 0.39)
  Top 0.254: U2.20 22.36,12.69 v22.99,12.06 | v23.5,9.53 23.24,9.27 23.24,7.49 26.16,4.57 31.21,4.57 R11.1
  Bottom 0.254: v23.5,9.53 22.99,10.03 v22.99,12.06 22.99,12.19 23.5,12.7 25.27,12.7 26.67,14.1 26.67,19.3 25.78,20.19 24.26,20.19 CONTROL.7
GPIO0_12  (via drill 0.39)
  Top 0.254: U2.16 22.46,10.69 22.73,10.41 23.75,10.41 24.89,9.27 27.81,9.27 v28.32,9.78 | v35.43,7.62 35.43,5.46 36.83,4.06 36.83,2.54 GPIO1.2 | R8.2 v30.73,17.53
  Bottom 0.254: v28.32,9.78 30.73,12.19 v30.73,17.53 33.91,17.53 35.05,16.38 35.05,8 v35.43,7.62
GPIO0_13  (via drill 0.39)
  Top 0.254: U2.17 v19.19,11.19 v19.18,11.18 | R12.3 26.78,7.11 v24.77,7.11
  Bottom 0.254: v19.18,11.18 20.32,10.03 20.32,8.89 22.1,7.11 v24.77,7.11 24.77,9.4 23.75,10.41 23.75,12.19 25.53,12.19 27.3,13.97 27.3,19.56 25.4,21.46 CONTROL.8
GPIO0_14  (via drill 0.39)
  Top 0.254: U2.21 23.01,13.19 24.51,11.68 v24.51,11.43 | v29.45,7.99 v29.46,8 29.43,7.96 R12.1
  Bottom 0.254: 25.53,11.3 27.94,13.72 CONTROL.9 | 25.53,11.3 25.4,11.43 v24.51,11.43 | 25.53,11.3 28.83,8 v29.46,8
L_AC  (via drill 0.39)
  Top 0.254: U3.20 40.02,11.45 39.62,11.05 39.62,9.78 v39.5,9.65 39.5,8.44 C1.1
  Bottom 0.254: v39.5,9.65 38.1,11.05 38.1,15.11 39.75,16.76 39.75,17.4 38.1,19.05 CONTROL.13
LEFT  (via drill 0.39)
  Top 0.254: v14.35,10.16 13.88,9.69 U2.47
  Top 0.406: R3.1 37.15,6.41 v36.45,5.71
  Bottom 0.254: v14.35,10.16 14.35,11.05 16,11.05 17.27,9.78 18.92,9.78 19.3,9.4 19.3,8.38 22.86,4.83 35.56,4.83 v36.45,5.71
MISO  (via drill 0.39)
  Top 0.254: 31.88,11.3 30.61,12.57 29.72,12.57 29.08,13.21 29.08,13.84 28.19,14.73 25.27,14.73 25.02,14.99 21.26,14.99 U2.24 | 31.88,11.3 32,11.3 U1.2 | TP1.TP 31.88,11.3
  Bottom 0.254: 31.24,10.79 TP1.TP
  other vias: 31.24,11.3
MOSI  (via drill 0.39)
  Top 0.254: v24.64,14.22 25.02,13.84 U1.5 | v20.57,16.38 19.76,16.38 U2.25
  Bottom 0.254: v20.57,16.38 22.48,14.48 | 22.48,14.48 22.73,14.22 v24.64,14.22 | TP2.TP 22.48,14.86 22.48,14.48
N$1
  Top 0.254: LED4.A 4.95,5.33 6.22,4.06 6.22,1.52 5.27,1.52 R7.1
N$2
  Top 0.406: R6.2 34.35,17.91 C12.1 35.5,16.16 C2.2
N$3
  Top 0.254: U2.45 11.26,10.69 C3.1
N$4
  Top 0.254: R1.2 23.11,16.07 Y2.3 21.47,15.95 21.02,15.49 20.45,15.49 19.68,14.73 19.68,13.72 19.3,13.34 18.41,13.34 17.91,13.84 17.91,14.61 17.53,14.99 17.53,16.13 U2.29
N$5  (via drill 0.39)
  Top 0.254: U2.32 16.01,14.62 16,14.61 v16,13.46 | C6.2 14.35,18.29 v13.21,17.14
  Bottom 0.254: v16,13.46 16,16.64 15.49,17.14 v13.21,17.14
N$6
  Top 0.406: R3.2 39.37,4.51 C11.1 39.75,4.25 C1.2
N$7  (via drill 0.39)
  Top 0.254: U3.9 v45.71,12.95 v45.72,12.95 | 44.26,17.46 v44.32,17.53
  Top 0.406: FB1.2 43.05,17.46 | 43.05,17.46 C5.1 | 43.05,17.46 44.26,17.46
  Bottom 0.254: v45.72,12.95 44.07,12.95 43.56,13.46 43.56,16.76 v44.32,17.53
N$8
  Top 0.254: R8.1 27.24,15.78 GREEN.C
N$9
  Top 0.254: U3.19 39.63,11.95 38.73,11.05 38.73,9.53 38.35,9.14 C15.2
N$10
  Top 0.254: C18.2 38.35,14.22 39.63,12.95 U3.17
N$12  (via drill 0.39)
  Top 0.254: U2.28 18.01,15.26 18.8,14.48 v18.8,14.22 | 24.77,18.34 R1.1 | 22.73,18.54 22.79,18.54 Y2.1
  Top 0.305: 24.77,18.34 Y2.1 | 22.73,18.54 22.61,18.67 v22.61,19.3
  Bottom 0.254: v18.8,14.22 18.8,17.14 19.3,17.65 20.95,17.65 v22.61,19.3
OUT_L_P
  Top 0.254: U3.2 41.79,9.01
  Top 0.305: 41.79,9.01 41.91,8.89 45.59,8.89 47.62,6.86 47.83,6.86 J1.2
OUT_LN
  Top 0.305: U3.5 47.72,10.47 J1.1
OUT_RN
  Top 0.305: U3.11 47.38,14.42 J2.2
OUT_RP
  Top 0.254: U3.14 41.79,14.85 41.53,15.11
  Top 0.305: 41.53,15.11 41.53,16 41.78,16.26 48.24,16.26 J2.1
PWRBUTTON  (via drill 0.39)
  Top 0.254: U2.37 11.39,14.69 v11.05,14.35 | C10.1 8.06,18.6 v7.87,18.79 v7.87,18.8 | R2.8 6.7,7.72 v6.73,7.75
  Bottom 0.254: 11.05,18.8 v11.05,14.35 11.81,13.59 11.81,8.38 9.4,5.97 6.86,5.97 6.73,6.1 v6.73,7.75 | 11.05,18.8 v7.87,18.8 | 11.05,18.8 11.94,18.8 14.35,21.21 14.86,21.21 CONTROL.4
R_AC  (via drill 0.39)
  Top 0.254: U3.16 C2.1 38.23,16 38.86,16.64 v38.86,17.14
  Bottom 0.254: CONTROL.12 35.56,20.45 v38.86,17.14
RIGHT  (via drill 0.39)
  Top 0.254: v14.35,12.06 14.35,12.19 13.36,13.19 U2.40 | R6.1 32.07,16.58 v31.88,16.38
  Bottom 0.254: v14.35,12.06 15.75,12.06 17.4,10.41 19.05,10.41 19.81,9.65 19.81,8.64 23.11,5.33 33.78,5.33 34.54,6.1 34.54,15.62 33.78,16.38 v31.88,16.38
RST
  Top 0.254: GPIO1.14 8.26,1.27 9.53,2.54 10.67,2.54 11.68,3.56 11.68,5.21 12.57,6.1 12.57,6.99 | R2.5 9.3,7.52 9.4,7.62 11.94,7.62 12.57,6.99 | 12.57,6.99 13.34,7.75 U2.1
RX  (via drill 0.39)
  Top 0.254: v18.03,19.05 D2.A 18.51,17.55 U2.27 | v24,8.38 24.38,8 25.02,8 25.03,7.99 25.85,7.99 R12.4
  Bottom 0.254: v18.03,19.05 17.27,18.29 17.27,13.72 18.41,12.57 19.3,12.57 20.83,11.05 20.83,9.14 21.59,8.38 v24,8.38
RX_5V
  Top 0.254: D2.C 20.32,18.29 CONTROL.6
SCK  (via drill 0.39)
  Top 0.254: U2.23 23.53,14.19 24.51,13.21 25.02,13.21 25.65,12.57 U1.6 27.94,12.57 v28.19,12.83
  Bottom 0.254: v28.19,12.83 28.19,11.81 TP3.TP
TX
  Top 0.254: U2.26 19.01,17.24 19.43,17.65 19.43,19.68 17.78,21.34 CONTROL.5
VBUS  (via drill 0.4)
  Top 0.406: X1.VBUS 6.33,12.73 D4.A 6.86,14.22 7.24,14.61 v7.24,15.11
  Bottom 0.406: CONTROL.3 12.7,20.95 11.43,19.68 7.37,19.68 6.99,19.3 6.99,15.37 v7.24,15.11
VDD  (via drill 0.39)
  Top 0.254: U2.30 17.01,14.74 17.4,14.35 17.4,13.46 17.78,13.08 17.78,12.95 | 17.78,12.95 17.78,12.19 17.01,11.43 17.01,8.26 | U1.8 U1.7 28.32,11.3 29.46,10.16 v29.46,9.53 | C7.2 10.92,3.94 v10.79,3.81 10.67,3.94 9.65,3.94 9.3,4.29 R2.4 R2.3 R2.2 | 17.01,8.13 17.02,8.12 17.02,8.25 17.01,8.26 | U1.3 34.54,12.57 | R9.5 R9.6 R9.7 | R9.7 R9.8 | R10.5 R10.6 R10.7 R10.8 21.68,4.1 v21.97,3.81 | 17.02,6.35 v17.14,6.22 17.01,6.35 U2.7 17.01,8.26 | U1.8 24.83,10.03 23.81,11.05 22.86,11.05 22.23,11.68 22.23,11.94 21.98,12.19 U2.19 20.07,12.19 19.43,12.83 17.91,12.83 17.78,12.95 | 26.53,10.03 U1.8 | R12.5 R12.6 R12.7 R12.8 29.5,6.26 v30.1,6.86 R11.8 R11.7 R11.6 R11.5 34.54,8.69 34.54,12.57 | GREEN.A 30.39,14.73 34.42,14.73 34.54,14.61 34.54,12.57 | R9.7 15.26,3.28 v15.49,3.05
  Bottom 0.254: v15.49,3.05 14.61,3.05 | 14.61,3.05 10.79,3.05 v10.79,3.81 | v21.97,3.81 19.56,3.81 v17.14,6.22 16.89,6.48 16.89,9.27 16.13,10.03 15.37,10.03 14.86,9.53 14.86,5.84 14.61,5.59 14.61,3.05 | v29.46,9.53 30.48,8.51 30.48,7.24 v30.1,6.86
VHIGH  (via drill 0.39)
  Top 0.254: U2.33 15.51,17.12 15.37,17.27 15.37,19.3 15.24,19.43 13.21,19.43 12.83,19.05 v12.83,18.29 12.83,18.16 | 11.43,16.89 11.43,16.83 | 11.24,16.89 C9.2 | D3.C 4.39,16.89 1.27,16.89 0.64,16.26 0.64,6.73 0.51,6.6 0.51,4.45 0.64,4.32 4,4.32 R7.2 | U3.7 44.95,11.95 44.96,11.94 44.96,12.06 | 44.96,12.06 44.96,12.45 U3.8 | 44.96,12.06 45.09,11.94 v45.72,11.94 | v42.29,15.49 U3.13 | U3.3 42.29,9.65 v44.2,9.65 | v24.13,19.3 25.91,19.3 | R4.2 44.96,3.24 44.96,4.06 43.49,5.53 C14.1 | v39.75,19.3 40.77,19.3 FB1.1 42.67,20.7 R5.2
  Top 0.406: D3.C 5.95,16.96 D4.C 7.12,16.7 C10.2 11.05,16.7 C9.2 | 12.83,18.16 11.5,16.83 C9.2 | 11.43,16.89 11.37,16.83 C9.2 | 25.65,19.3 25.91,19.3 29.84,19.3 30.1,19.56 33.15,19.56 33.78,20.19 38.86,20.19 v39.75,19.3 | C4.1 43.49,7.24 | 43.49,7.24 C14.1 | v44.83,7.11 43.62,7.11 43.49,7.24
  Bottom 0.254: v42.29,15.49 42.29,13.72 44.07,11.94 v45.72,11.94 45.72,10.16 45.21,9.65 44.7,9.65 | 44.7,9.65 v44.2,9.65 | v44.83,7.11 44.83,9.53 44.7,9.65 | v12.83,18.29 12.83,18.92 13.72,19.81 15.24,19.81 16,20.57 16.89,20.57 17.14,20.32 22.73,20.32 23.75,19.3 v24.13,19.3
  Bottom 0.305: v39.75,19.3 42.29,16.76 v42.29,15.49
VIN
  Top 0.406: CONTROL.1 7.44,21.41 D3.A
  Bottom 0.406: X2.2 9.67,10.43 10.16,10.92 10.16,13.34 9.53,13.97 6.6,13.97 6.35,14.22 6.35,20.32 CONTROL.1

### Text on the board
tPlace: Vin | Gnd | PB | TX | RX | UG | + | Vol | - | CS | Gnd | R | L | Gnd | BUS | + | Act | R | - | 2x2W Amp | - | adafruit | L | + | Pwr | 0 | 1 | Sound Board | Rst | 2 | 3 | 4 | 10 | Act | Gnd | 5 | 6 | 7 | 8 | 9
bPlace: G0 | Adafruit Audio FX Sound Board | Vin:3-5VDC | 2W Class D Amp | + | 4-8Ω Speakers | R | - | Vin / JST | 11 GPIO / Triggers / or UART | - | Pin to GND / For Trigger | L | + | WAV or OGG / Stereo Files | T00.WAV / T01HOLDL.OGG / T02LATCH.WAV / T03RAND0.OGG..T03RAND9.OGG / T04NEXT0.WAV..T04NEXT9.WAV / ... -> T10.WAV | G1